# EAGLE design CCM_0020_transmitter (EAGLE 9.4.2)
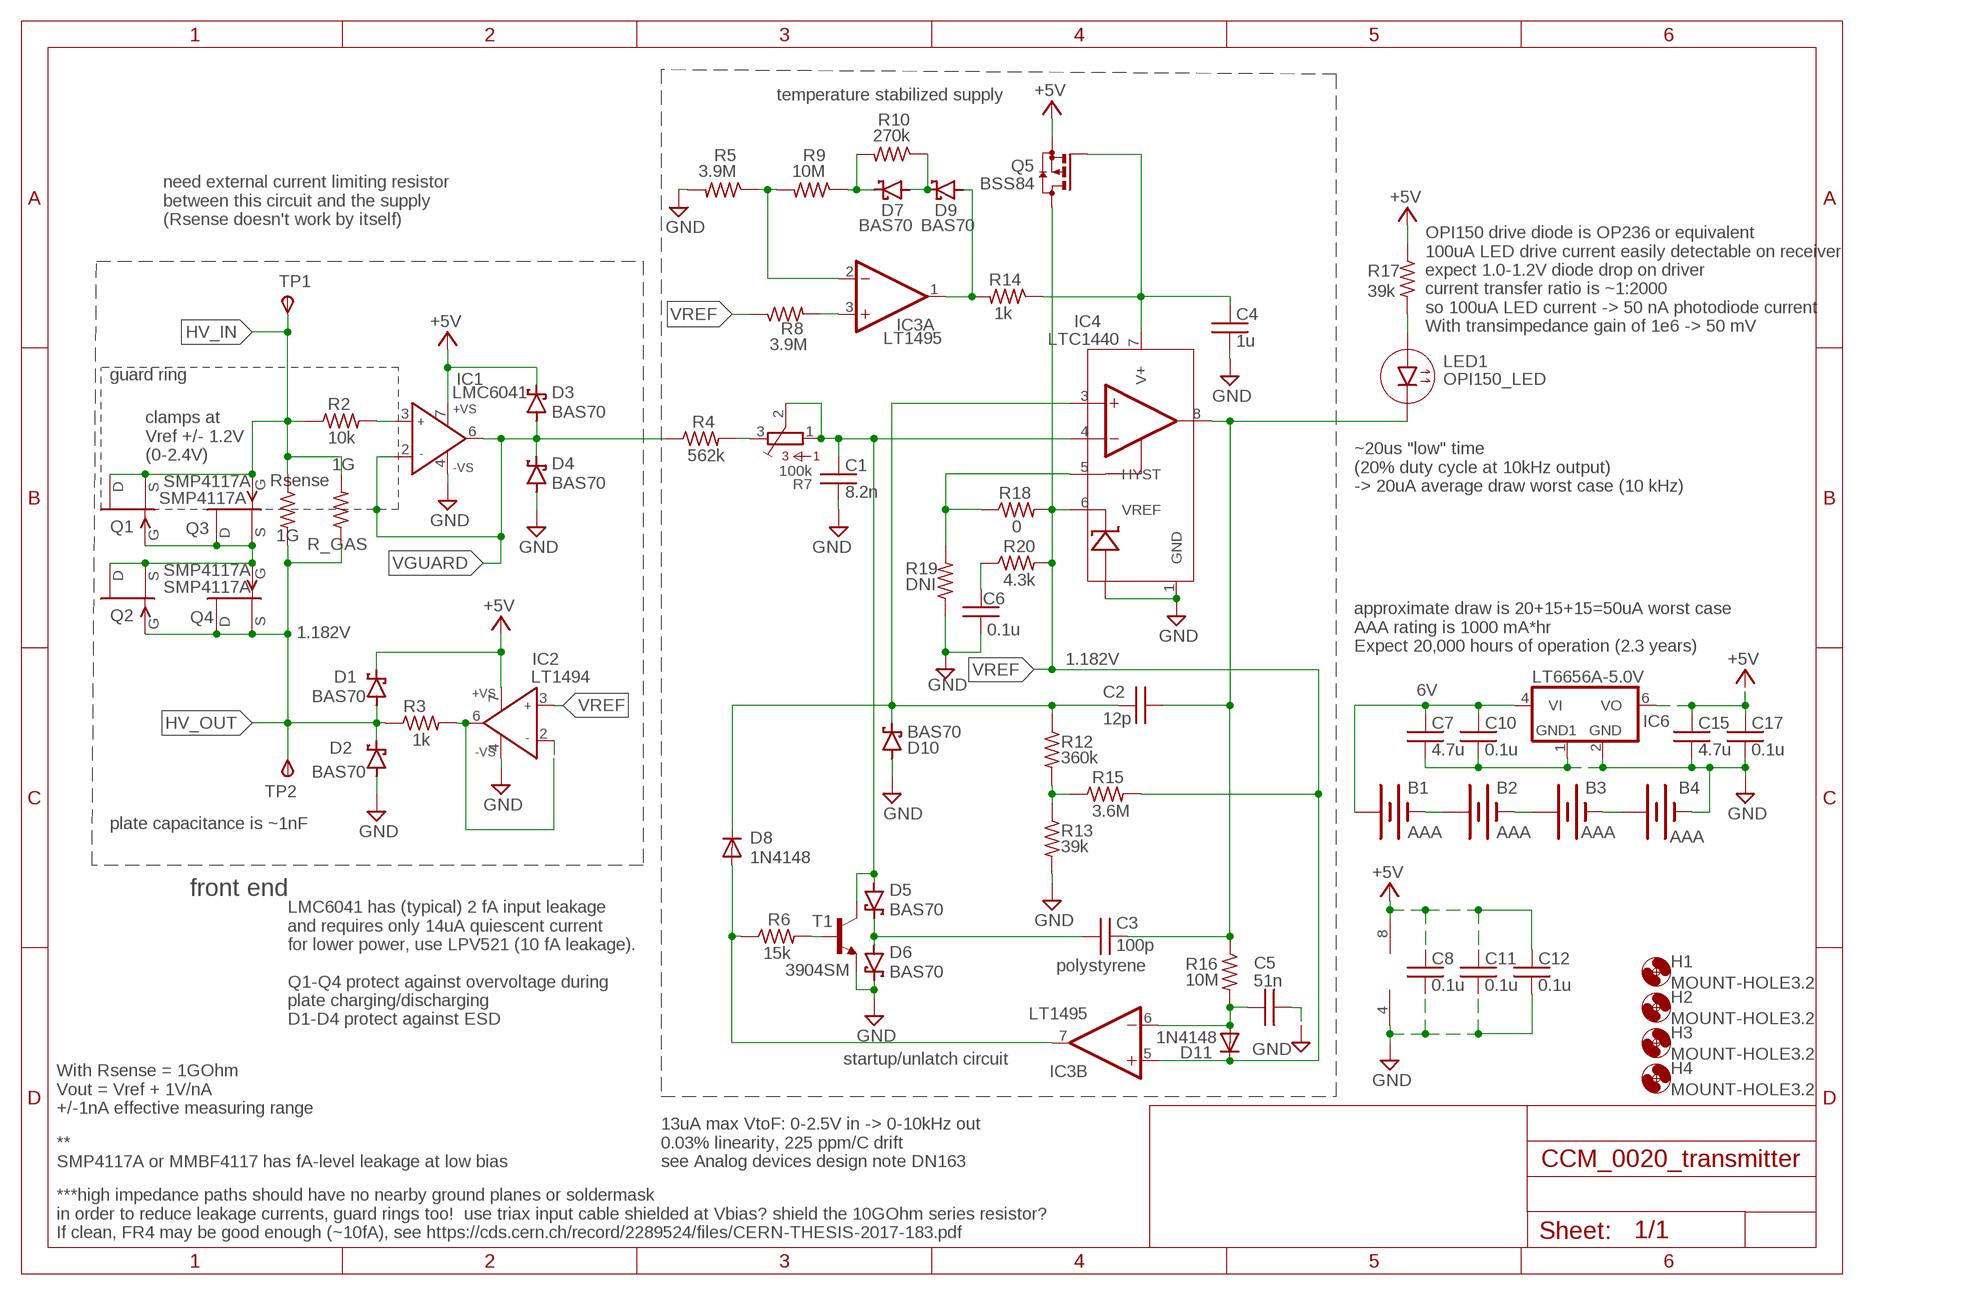
[diagram p0: schematic, sheet 1]

## Parts
B1  AAA  [AAA_SM]
B2  AAA  [AAA_SM]
B3  AAA  [AAA_SM]
B4  AAA  [AAA_SM]
C1  8.2n  C0603  [0603]
C2  12p  C0603  [0603]
C3  100p  C0603  [0603]
C4  1u  C0603  [0603]
C5  51n  C0603  [0603]
C6  0.1u  C0603  [0603]
C7  4.7u  C0603  [0603]
C8  0.1u  C0603  [0603]
C10  0.1u  C0603  [0603]
C11  0.1u  C0603  [0603]
C12  0.1u  C0603  [0603]
C15  4.7u  C0603  [0603]
C17  0.1u  C0603  [0603]
D1  BAS70  [SOT23]
D2  BAS70  [SOT23]
D3  BAS70  [SOT23]
D4  BAS70  [SOT23]
D5  BAS70  [SOT23]
D6  BAS70  [SOT23]
D7  BAS70  [SOT23]
D8  1N4148  [SOD323_ST]
D9  BAS70  [SOT23]
D10  BAS70  [SOT23]
D11  1N4148  [SOD323_ST]
H1  MOUNT-HOLE3.2  [3,2]
H2  MOUNT-HOLE3.2  [3,2]
H3  MOUNT-HOLE3.2  [3,2]
H4  MOUNT-HOLE3.2  [3,2]
IC1  LMC6041  AD825_A  [SO08]
IC2  LT1494  AD825_A  [SO08]
IC3  LT1495  LM393D  [SO08]
IC4  LTC1440  [SO8]
IC6  LT6656A-5.0V  LT6656  [SOT23-6]
LED1  OPI150_LED  [OPI150_LED]
Q1  SMP4117A  SST5484  [SOT23]
Q2  SMP4117A  SST5484  [SOT23]
Q3  SMP4117A  SST5484  [SOT23]
Q4  SMP4117A  SST5484  [SOT23]
Q5  BSS84  [SOT23]
R1  1G  RESISTOR2512  [2512]
R2  10k  R0603  [0603]
R3  1k  R0603  [0603]
R4  562k  R0603  [0603]
R5  3.9M  R0603  [0603]
R6  15k  R0603  [0603]
R7  100k  3386-C  [3386C]
R8  3.9M  R0603  [0603]
R9  10M  R0603  [0603]
R10  270k  R0603  [0603]
R12  360k  R0603  [0603]
R13  39k  R0603  [0603]
R14  1k  R0603  [0603]
R15  3.6M  R0603  [0603]
R16  10M  R0603  [0603]
R17  39k  R0603  [0603]
R18  0  R0603  [0603]
R19  DNI  R0603  [0603]
R20  4.3k  R0603  [0603]
R_GAS  1G  R-US_0309/10  [0309/10]
T1  3904SM  [SOT23]
TP1  TPSPAD1-17  [P1-17]
TP2  TPSPAD1-17  [P1-17]

## Nets
+5V: C8.1 C11.1 C12.1 C15.1 C17.1 D1.3(C) D3.3(C) IC1.7(+VS) IC2.7(+VS) IC3.8(P:V+) IC6.6(VO) Q5.2(S) R17.1
GND: B4.- C1.2 C4.2 C5.2 C6.1 C7.2 C8.2 C10.2 C11.2 C12.2 C15.2 C17.2 D2.1(A) D4.1(A) D6.3(C) D10.1(A) IC1.4(-VS) IC2.4(-VS) IC3.4(P:V-) IC4.1(GND) IC4.2(V-) IC6.1(GND1) IC6.2(GND) R5.2 R13.2 R19.1 T1.2(E)
HV_IN: Q1.1(D) Q1.2(S) Q3.3(G) R1.1 R2.1 R_GAS.2 TP1.TP(PP)
HV_IN1: Q1.3(G) Q2.1(D) Q2.2(S) Q3.1(D) Q3.2(S) Q4.3(G)
HV_OUT: D1.1(A) D2.3(C) Q2.3(G) Q4.1(D) Q4.2(S) R1.2 R3.1 R_GAS.1 TP2.TP(PP)
HYST: IC4.5(HYST) R18.1 R19.2
N$2: C4.1 IC4.7(V+) Q5.1(G) R14.1
N$3: LED1.P$1(1(A)) R17.2
N$4: B1.- B2.+
N$6: R4.2 R7.3
N$7: IC1.3(IN+) R2.2
N$9: C6.2 R20.1
N$10: C1.1 D5.1(A) IC4.4(-IN) R7.1 R7.2 T1.3(C)
N$11: C3.1 D5.3(C) D6.1(A)
N$12: R6.2 T1.1(B)
N$13: D8.A IC3.7(B:OUT) R6.1
N$14: R12.2 R13.1 R15.1
N$15: C2.1 D8.C D10.3(C) IC4.3(+IN) R12.1
N$16: C5.1 D11.A IC3.6(B:-IN) R16.2
N$18: D7.1(A) D9.3(C) R10.1
N$19: D7.3(C) R9.1 R10.2
N$20: IC3.2(A:-IN) R5.1 R9.2
N$22: B1.+ C7.1 C10.1 IC6.4(VI)
N$23: D9.1(A) IC3.1(A:OUT) R14.2
N$25: IC3.3(A:+IN) R8.2
N$26: B2.- B3.+
N$27: B3.- B4.+
N$28: IC2.2(IN-) IC2.6(OUT) R3.2
VGUARD: D3.1(A) D4.3(C) IC1.2(IN-) IC1.6(OUT) R4.1
VREF: D11.C IC2.3(IN+) IC3.5(B:+IN) IC4.6(VREF) Q5.3(D) R8.1 R15.2 R18.2 R20.2
VTOF_OUTPUT: C2.2 C3.2 IC4.8(OUT) LED1.P$2(2(C)) R16.1

## Notes on the sheet
- temperature stabilized supply
- need external current limiting resistor
  between this circuit and the supply
  (Rsense doesn't work by itself)
- OPI150 drive diode is OP236 or equivalent
  100uA LED drive current easily detectable on receiver
  expect 1.0-1.2V diode drop on driver
  current transfer ratio is ~1:2000
  so 100uA LED current -> 50 nA photodiode current
  With transimpedance gain of 1e6 -> 50 mV
- guard ring
- clamps at 
  Vref +/- 1.2V
  (0-2.4V)
- Rsense
- ~20us "low" time
  (20% duty cycle at 10kHz output)
  -> 20uA average draw worst case (10 kHz)
- 1.182V
- approximate draw is 20+15+15=50uA worst case
  AAA rating is 1000 mA*hr
  Expect 20,000 hours of operation (2.3 years)
- 1.182V
- 6V
- plate capacitance is ~1nF
- front end
- polystyrene
- LMC6041 has (typical) 2 fA input leakage
  and requires only 14uA quiescent current
  for lower power, use LPV521 (10 fA leakage).
  
  Q1-Q4 protect against overvoltage during 
  plate charging/discharging  
  D1-D4 protect against ESD
- startup/unlatch circuit
- With Rsense = 1GOhm
  Vout = Vref + 1V/nA
  +/-1nA effective measuring range
- **
  SMP4117A or MMBF4117 has fA-level leakage at low bias
- 13uA max VtoF: 0-2.5V in -> 0-10kHz out
  0.03% linearity, 225 ppm/C drift
  see Analog devices design note DN163
- ***high impedance paths should have no nearby ground planes or soldermask
  in order to reduce leakage currents, guard rings too!  use triax input cable shielded at Vbias? shield the 10GOhm series resistor?
  If clean, FR4 may be good enough (~10fA), see https://cds.cern.ch/record/2289524/files/CERN-THESIS-2017-183.pdf

## Library data of the parts
B1-B4 = noah:AAA
C1-C8 C10-C12 C15 C17 = acrooptics:C: Capacitor
D1-D7 D9 D10 = diode:BAS70: Silicon Schottky Diodes General-purpose diode for high-speed switching
D8 D11 = custom_parts:1N4148: DIODE high speed (Philips)
H1-H4 = holes:MOUNT-HOLE: MOUNTING HOLE with drill center marker
IC1 IC2 = noah:AD825_A: Low Cost, General-Purpose High Speed JFET Amplifier Source: http://www.analog.com/static/imported-files/data_sheets/AD825.pdf
IC3 = linear:LM393: COMPARATOR
IC4 = noah:LTC1440
IC6 = noah:LT6656
LED1 = noah:OPI150_LED
Q1-Q4 = transistor-fet:?548*: N-Channel JFETs Source: VISHAY 2N5484.pdf Compatible: TO92 2N5245 J304 J305 U310 J308 J309 J310 TO72 2N4416 2N4416A 2N3823 2N4351 3N169 3N170 3N171 MFE3002 TO18 2N3796 2N3797 MFE825 Source: Motorola European Master Guide Pacge 3-59
Q5 = transistor-small-signal:BSS84: P-CHANNEL MOS FET
R1 = noah:RESISTOR: RESISTOR, American symbol
R2-R6 R8-R10 R12-R20 = acrooptics:R: 0603 resistor
R7 = bourns:3386-: 3386 Series 3/8" Square Trimmer
R_GAS = rcl:R-US_: RESISTOR, American symbol; SPICEPREFIX: R
T1 = noah:3904: NPN TRANSISTOR
TP1 TP2 = testpad:TPS: TEST PIN

## Net classes
1 standard: width 0.61 mm, clearance 0.254 mm

## Board
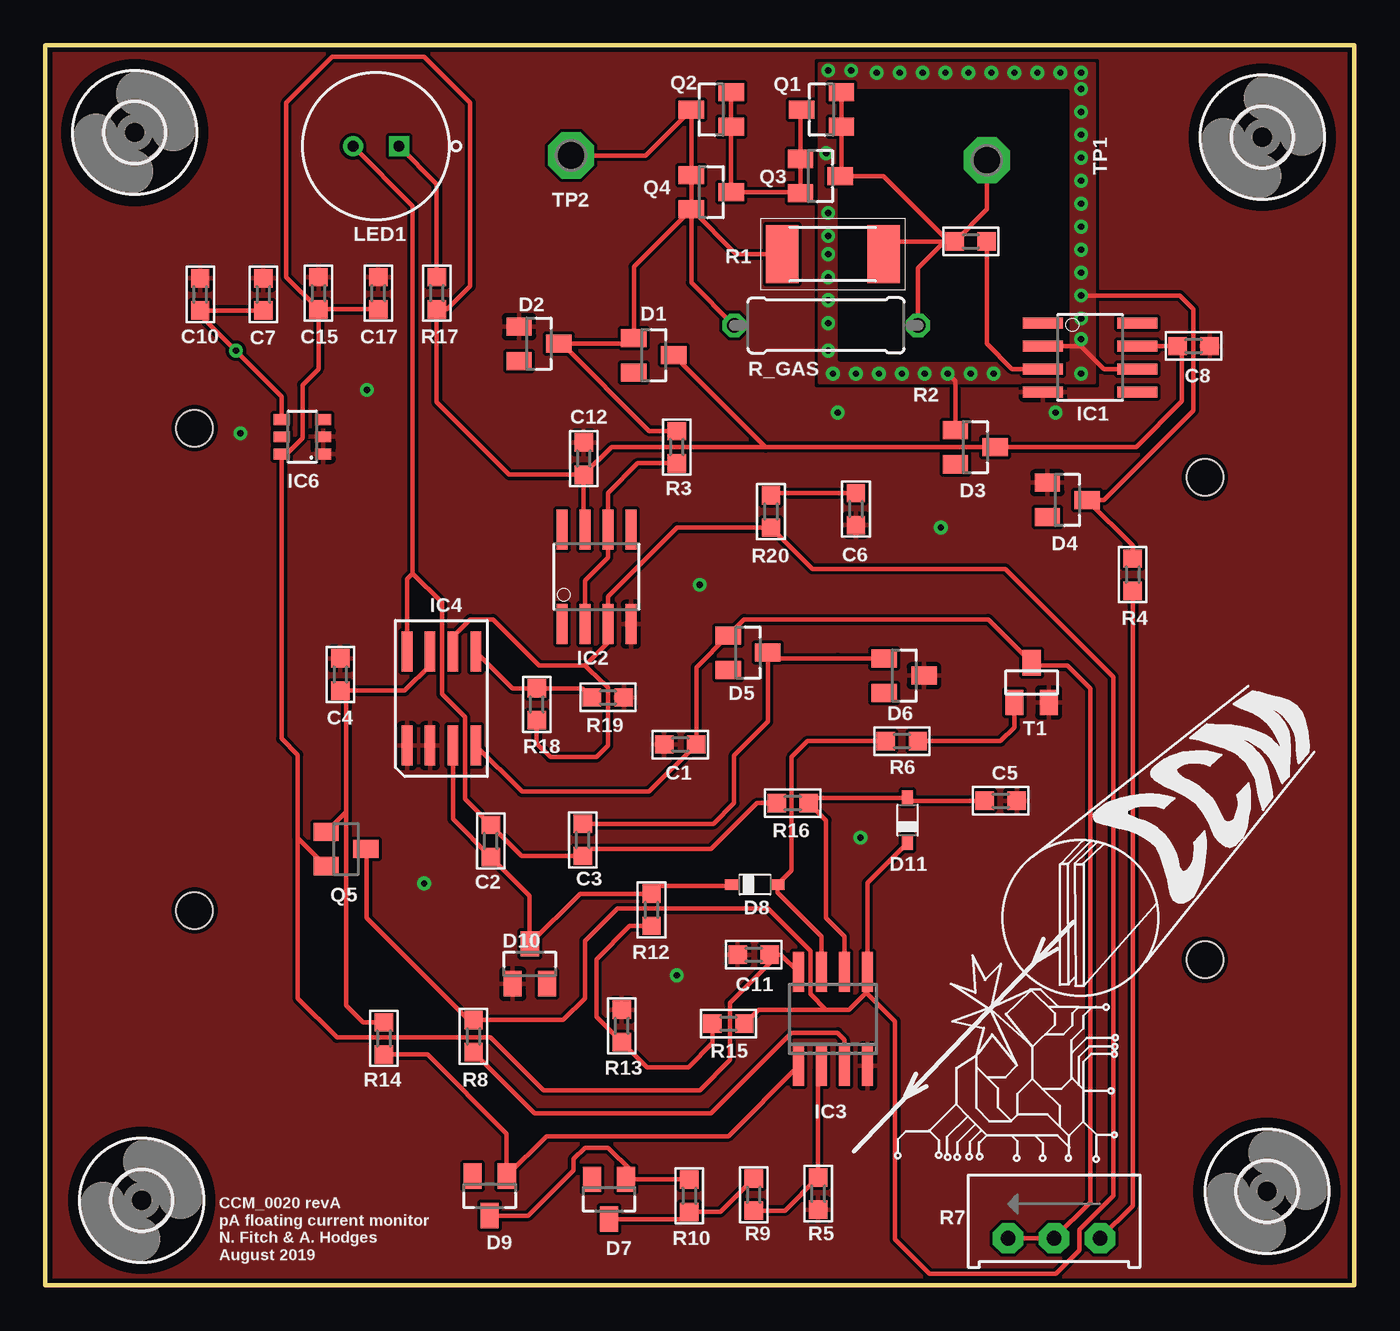
[diagram p1: board, top side]
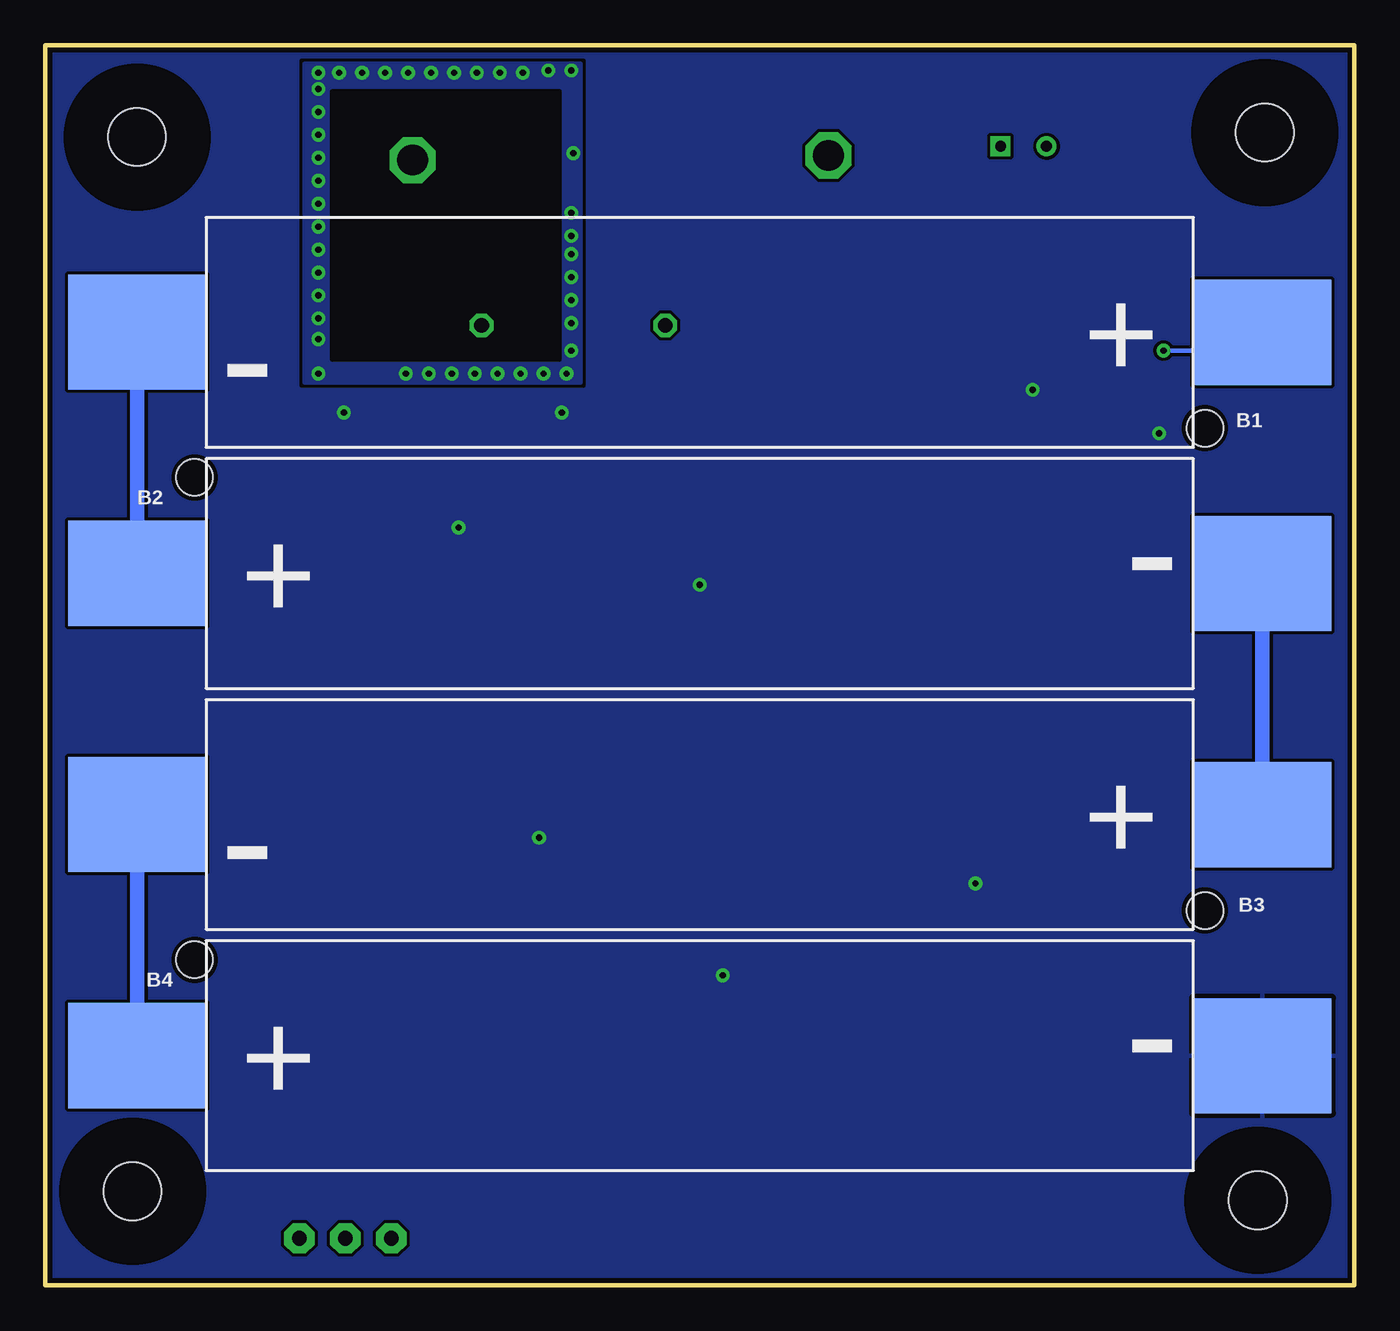
[diagram p2: board, bottom side, seen from below]

Size 72.39 x 68.58 mm. Coordinates in mm from the lower left corner, seen from the top.
Outline: 0,0 72.39,0 72.39,68.58 0,68.58 0,0
Copper layers (1*16): Top 0.035mm / dielectric 1.5mm / Bottom 0.035mm
Design rules "default *": minimum track width 10mil, minimum drill 10mil, track to track 7mil, track to pad 7mil, pad to pad 7mil, via to via 7mil, smd to smd 7mil, copper to edge 10mil, drill to drill 8mil, minimum pad ring 10mil, minimum via ring 8mil, stop-mask expansion 4mil, vias tented up to drill 0mil, thermal gap 10mil

### Footprints (pad centres in the part's own frame; a part is rotated, then mirrored left to right if it is on the bottom)
AAA_SM = smd 7.62 x 5.842: + -3.175,0 | smd 7.62 x 6.35: - 59.055,0 | hole 2.032: 0,5.309
0603 = smd 1.016 x 1.016: 1 -0.889,0; 2 0.889,0
SOT23 = smd 1 x 1.4: 1 -0.95,-1.1; 2 0.95,-1.1; 3 0,1.1
SOD323_ST = smd 0.8 x 0.6: A 1.25,0; C -1.25,0
3,2 = hole 3.2: 0,0
SO08 = smd 0.61 x 2.21: 1 -1.905,-2.616; 2 -0.635,-2.616; 3 0.635,-2.616; 4 1.905,-2.616; 5 1.905,2.616; 6 0.635,2.616; 7 -0.635,2.616; 8 -1.905,2.616
SO08' = smd 0.6 x 2.2: 1 -1.905,-2.6; 2 -0.635,-2.6; 3 0.635,-2.6; 4 1.905,-2.6; 5 1.905,2.6; 6 0.635,2.6; 7 -0.635,2.6; 8 -1.905,2.6
SO8 = smd 0.6 x 2.2: 1 -1.905,-2.6; 2 -0.635,-2.6; 3 0.635,-2.6; 4 1.905,-2.6; 5 1.905,2.6; 6 0.635,2.6; 7 -0.635,2.6; 8 -1.905,2.6
SOT23-6 = smd 0.6 x 0.9: 1 -0.95,-1.15; 2 0,-1.15; 3 0.95,-1.15; 4 0.95,1.15; 5 0,1.15; 6 -0.95,1.15
OPI150_LED = drill 0.6 square: P$1 0,1.27 | drill 0.6: P$2 0,-1.27
2512 = smd 1.8 x 3.2: 1 -2.8,0; 2 2.8,0
3386C = drill 0.813 pad 1.676 octagon: 1 2.54,1.27; 2 0,1.27; 3 -2.54,1.27
0309/10 = drill 0.813 octagon: 1 -5.08,0; 2 5.08,0
P1-17 = drill 1.702 pad 2.54 octagon: TP 0,0

### Placement (x,y rotation side)
B1  8.26,52.7 180 bottom
B2  64.14,39.37 0 bottom
B3  8.26,26.04 180 bottom
B4  64.14,12.7 0 bottom
C1  35.12,29.91 180 top
C2  24.64,24.57 90 top
C3  29.72,24.64 270 top
C4  16.32,33.78 90 top
C5  52.83,26.8 0 top
C6  44.83,42.93 90 top
C7  12.06,54.8 90 top
C8  63.5,51.94 0 top
C10  8.57,54.8 90 top
C11  39.18,18.29 180 top
C12  29.78,45.72 90 top
C15  15.11,54.86 90 top
C17  18.41,54.86 90 top
D1  33.66,51.44 270 top
D2  27.3,52.07 270 top
D3  51.44,46.35 270 top
D4  56.52,43.43 270 top
D5  38.86,34.99 270 top
D6  47.5,33.72 270 top
D7  31.18,4.76 180 top
D8  39.24,22.16 0 top
D9  24.57,4.95 180 top
D10  26.8,17.78 0 top
D11  47.69,25.72 90 top
H1  5.33,4.7 0 top
H2  67.56,5.21 0 top
H3  4.95,63.75 0 top
H4  67.31,63.5 0 top
IC1  57.78,51.31 270 top
IC2  30.48,39.18 0 top
IC3  LT1495  [SO08']  43.56,14.73 0 top
IC4  21.91,32.45 0 top
IC6  14.22,46.93 90 top
LED1  18.29,62.99 270 top
Q1  42.93,65.02 90 top
Q2  36.83,65.02 90 top
Q3  42.86,61.34 270 top
Q4  36.83,60.45 270 top
Q5  16.64,24.13 270 top
R1  43.56,57.02 180 top
R2  51.18,57.72 0 top
R3  34.92,46.35 270 top
R4  60.13,39.31 270 top
R5  42.74,5.08 270 top
R6  47.37,30.1 0 top
R7  55.79,3.87 180 top
R8  23.69,13.78 270 top
R9  39.18,5.02 270 top
R10  35.62,4.95 270 top
R12  33.53,20.76 270 top
R13  31.88,14.35 90 top
R14  18.73,13.65 270 top
R15  37.78,14.48 0 top
R16  41.34,26.67 0 top
R17  21.65,54.86 90 top
R18  27.18,32.13 270 top
R19  31.11,32.51 180 top
R20  40.13,42.8 270 top
R_GAS  43.18,53.09 0 top
T1  54.55,33.34 0 top
TP1  52.07,62.23 270 top
TP2  29.08,62.48 270 top

### Tracks (layer width: path | path; a pad name or v marks a point on that pad's centre or on a via)
+5V
  Top 0.254: C12.1 25.65,44.83 21.65,48.83 R17.1 22.23,53.98 23.5,55.24 23.5,65.41 20.95,67.94 15.88,67.94 13.34,65.41 13.34,55.75 C15.1 | C12.1 31.3,46.35 39.84,46.35 | IC1.7 C8.1 62.87,51.69 62.87,48.9 60.33,46.35 D3.3 39.84,46.35 | Q5.2 13.97,24.75 | 13.97,24.75 13.97,15.88 16.14,13.7 16.15,13.72 24.64,13.72 27.56,10.79 36.2,10.79 37.86,12.46 37.86,15.63 40.07,17.84 C11.1 40.7,18.29 IC3.8 | 13.97,24.75 13.97,29.34 13.07,30.23 IC6.6 13.34,45.98 14.22,46.86 14.22,49.78 15.11,50.67 C15.1 | C15.1 C17.1 | IC2.7 29.78,41.86 C12.1 | D1.3 39.84,46.35
GND  (via drill 0.35)
  other vias: 10.79,47.12 34.92,17.14 17.78,49.53 43.81,48.26 45.09,24.77 20.95,22.23 36.2,38.73 49.53,41.91 55.88,48.26
  pour Bottom (rank 4): 72.39,0 0,0 0,68.58 72.39,68.58
  pour Top (rank 3): 0,68.58 72.39,68.58 72.39,0 0,0
  cutout Top: 43.94,51.18 56.52,51.18 56.52,66.04 43.94,66.04
  cutout Bottom: 56.52,51.18 43.94,51.18 43.94,66.04 56.52,66.04
HV_IN
  Top 0.254: Q1.2 Q1.1 44.03,61.4 Q3.3 46.35,61.34 49.97,57.72 R2.1 | R_GAS.2 48.26,56.26 49.72,57.72 R2.1 | R2.1 47.06,57.72 R1.1 | R2.1 52.07,59.5 TP1.TP
HV_IN1
  Top 0.254: Q3.2 41.7,60.45 Q4.3 Q2.1 Q2.2 | Q3.2 41.76,64.96 Q1.3 | Q3.1 Q3.2
HV_OUT
  Top 0.254: Q4.2 Q4.1 Q2.3 33.19,62.48 TP2.TP | Q4.2 32.55,56.33 D1.1 32.24,52.07 28.57,52.07 | Q4.2 38.21,57.02 R1.2 | 28.57,52.07 D2.3 | R_GAS.1 35.73,55.46 Q4.2 | R3.1 33.4,47.24 28.57,52.07
HYST
  Top 0.254: R19.2 29.72,33.02 R18.1 25.84,33.02 IC4.5
N$2
  Top 0.254: IC4.7 21.27,34.29 19.88,32.89 C4.1 16.64,32.58 16.64,26.18 | 16.64,26.18 16.64,15.49 17.59,14.54 R14.1 | Q5.1 16.64,26.18
N$3
  Top 0.254: LED1.P$1 21.65,60.9 R17.2
N$4
  Bottom 0.813: B1.- B2.+
N$6
  Top 0.254: R4.2 60.13,4.4 R7.3
N$7
  Top 0.254: 54.6,50.67 IC1.3 53.47,50.67 52.07,52.07 R2.2
N$9
  Top 0.254: R20.1 40.26,43.81 C6.2
N$10
  Top 0.254: IC4.4 26.36,27.3 33.4,27.3 C1.1 36.01,34.18 D5.1 38.65,36.83 52.15,36.83 T1.3 54.69,34.29 56.52,34.29 57.78,33.02 57.78,4.59 R7.2 R7.1
N$11
  Top 0.254: C3.1 36.96,25.53 38.1,26.67 38.1,29.32 39.96,31.18 D5.3 40.28,34.67 43.81,34.67 | 43.81,34.67 D6.1 | 43.81,34.67
N$12
  Top 0.254: R6.2 52.83,30.1 53.6,30.86 T1.1
N$13
  Top 0.254: IC3.7 42.93,19.3 40.49,21.74 D8.A 41.27,22.94 41.27,29.21 42.16,30.1 R6.1
N$14
  Top 0.254: R12.2 32.32,19.88 30.48,18.03 30.48,14.86 R13.1 33.27,12.06 35.56,12.06 36.89,13.4 R15.1
N$15
  Top 0.254: D8.C 37.93,22.1 33.97,22.1 R12.1 29.57,21.65 D10.3 26.8,21.53 C2.1 22.54,25.78 IC4.3
N$16
  Top 0.254: C5.1 47.86,26.8 D11.A 42.52,26.97 R16.2 43.18,25.72 43.18,20.32 44.2,19.3 IC3.6
N$18
  Top 0.254: D7.1 32.38,5.86 | 32.38,5.86 35.6,5.86 R10.1 | D9.3 26.71,3.85 29.21,6.35 29.21,6.99 29.84,7.62 31.11,7.62 32.38,6.35 32.38,5.86
N$19
  Top 0.254: R9.1 37.34,4.06 R10.2 35.22,3.66 D7.3
N$20
  Top 0.254: R9.2 40.89,4.13 R5.1 42.74,11.94 IC3.2
N$22  (via drill 0.35)
  Top 0.254: C7.1 C10.1 8.57,53.66 v10.54,51.69 13.07,49.16 IC6.4
  Bottom 0.254: v10.54,51.69 8,51.69 6.99,52.7 B1.+
N$23
  Top 0.254: IC3.1 37.78,8.26 27.73,8.26 D9.1 25.52,8.38 21.14,12.76 R14.2
N$25
  Top 0.254: IC3.3 44.2,13.59 43.81,13.97 41.27,13.97 36.83,9.53 27.05,9.53 R8.2
N$26
  Bottom 0.813: B2.- B3.+
N$27
  Bottom 0.813: B3.- B4.+
N$28
  Top 0.254: IC2.2 29.84,38.99 31.11,40.26 IC2.6 31.11,43.81 32.77,45.47 R3.2
VGUARD  (via drill 0.35)
  Top 0.254: IC1.2 57.28,51.94 58.55,50.67 IC1.6 | D3.1 50.34,49.99 v49.91,50.42 | v57.28,54.74 62.74,54.74 63.5,53.98 63.5,48.39 58.55,43.43 D4.3 60.13,40.91 R4.1
  other vias: 57.28,50.42 57.28,53.47 57.28,56.01 57.28,57.28 57.28,58.55 57.28,59.82 57.28,61.09 57.28,62.36 57.28,63.63 57.28,64.9 57.28,66.17 56.13,67.06 54.86,67.06 53.59,67.06 52.32,67.06 51.05,67.06 49.78,67.06 48.51,67.06 47.24,67.06 45.97,67.06 44.58,67.18 43.31,67.18 43.31,57.02 43.31,55.75 43.31,54.48 43.31,53.21 43.56,50.42 44.83,50.42 46.1,50.42 47.37,50.42 48.64,50.42 51.18,50.42 52.45,50.42 57.28,67.06 57.28,52.32 43.31,51.69 43.31,58.04 43.31,59.31 43.18,62.61
  pour Top (rank 2, no thermals): 58.04,49.91 58.04,67.56 42.8,67.56 42.8,49.91
  pour Bottom (rank 2, no thermals): 58.04,67.56 42.8,67.56 42.8,49.91 58.04,49.91
VREF
  Top 0.254: Q5.3 17.78,24.09 17.78,20.32 23.37,14.73 23.62,14.73 R8.1 28.64,14.67 29.84,15.88 29.84,19.05 31.64,20.84 32.38,20.84 32.74,20.84 39.98,20.84 42.32,18.5 42.32,16.11 43.18,15.25 43.18,15.24 | IC3.5 45.47,22.25 D11.C | IC3.5 45.47,16.26 44.45,15.24 43.18,15.24 | R15.2 39.43,15.24 43.18,15.24 | 29.84,34.29 27.3,34.29 24.77,36.83 23.5,36.83 22.54,35.88 IC4.6 | 29.84,34.29 31.11,35.56 IC2.3 31.11,38.1 34.92,41.91 R20.2 42.42,39.62 53.09,39.62 59.05,33.66 59.05,4.94 57.19,3.07 57.19,1.94 55.88,0.64 48.9,0.64 46.99,2.54 46.99,14.61 45.47,16.13 IC3.5 | 29.84,34.29 30.81,33.33 30.86,33.33 31.11,33.07 31.11,29.84 30.48,29.21 27.94,29.21 27.18,29.97 R18.2
VTOF_OUTPUT
  Top 0.254: R16.1 39.37,26.67 36.83,24.13 30.1,24.13 C3.2 26.35,23.75 C2.2 23.46,26.64 23.21,26.89 23.21,31.43 21.94,32.7 21.94,37.75 20.32,39.37 | LED1.P$2 20.32,59.69 20.32,39.37 | 20.32,39.37 20,39.05 IC4.8

### Text on the board
tPlace: CCM_0020 revA / pA floating current monitor / N. Fitch & A. Hodges / August 2019